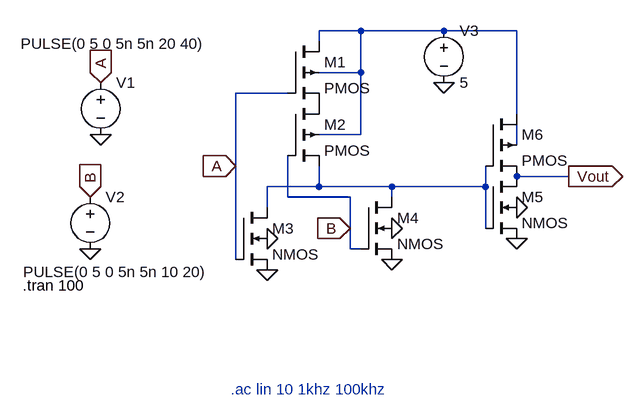
[diagram p0: schematic OR gate.asc]
OR gate.asc, the LTspice schematic file:
Version 4.1
SHEET 1 880 752
WIRE 288 48 224 48
WIRE 416 48 288 48
WIRE 528 48 416 48
WIRE 224 64 224 48
WIRE 288 112 288 48
WIRE 288 112 224 112
WIRE 176 144 96 144
WIRE 528 176 528 48
WIRE 288 208 288 112
WIRE 288 208 224 208
WIRE 528 224 528 192
WIRE 96 256 96 144
WIRE 608 272 528 272
WIRE 224 288 224 256
WIRE 224 288 144 288
WIRE 336 288 224 288
WIRE 480 288 480 256
WIRE 480 288 336 288
WIRE 176 304 176 240
WIRE 272 304 176 304
WIRE 336 304 336 288
WIRE 144 320 144 288
WIRE 272 352 272 304
WIRE 480 352 480 288
WIRE 272 384 272 352
WIRE 288 384 272 384
WIRE 96 400 96 256
FLAG -128 384 0
FLAG -112 208 0
FLAG 144 416 0
FLAG 336 400 0
FLAG 336 352 0
FLAG 144 368 0
FLAG 416 128 0
FLAG -112 128 A
IOPIN -112 128 In
FLAG 96 256 A
IOPIN 96 256 In
FLAG -128 304 B
IOPIN -128 304 In
FLAG 272 352 B
IOPIN 272 352 In
FLAG 528 368 0
FLAG 528 320 0
FLAG 608 272 Vout
IOPIN 608 272 Out
DATAFLAG -128 304 ""
SYMBOL pmos4 176 64 R0
SYMATTR InstName M1
SYMBOL pmos4 176 160 R0
SYMATTR InstName M2
SYMBOL nmos4 96 320 R0
SYMATTR InstName M3
SYMBOL nmos4 288 304 R0
SYMATTR InstName M4
SYMBOL voltage -112 112 R0
WINDOW 3 -123 -44 Left 2
WINDOW 123 0 0 Left 0
WINDOW 39 0 0 Left 0
SYMATTR Value PULSE(0 5 0 5n 5n 20 40)
SYMATTR InstName V1
SYMBOL voltage -128 288 R0
WINDOW 3 -103 131 Left 2
WINDOW 123 0 0 Left 0
WINDOW 39 0 0 Left 0
SYMATTR Value PULSE(0 5 0 5n 5n 10 20)
SYMATTR InstName V2
SYMBOL voltage 416 32 R0
WINDOW 123 0 0 Left 0
WINDOW 39 0 0 Left 0
SYMATTR InstName V3
SYMATTR Value 5
SYMBOL nmos4 480 272 R0
SYMATTR InstName M5
SYMBOL pmos4 480 176 R0
SYMATTR InstName M6
TEXT -232 440 Left 2 !.tran 100
TEXT 88 600 Left 2 ;.ac lin 10 1khz 100khz

The netlist it stands for:
* OR gate.asc
M1 N001 A P001 N001 PMOS
M2 P001 B N003 N001 PMOS
M3 N003 A 0 0 NMOS
M4 N003 B 0 0 NMOS
V1 A 0 PULSE(0 5 0 5n 5n 20 40)
V2 B 0 PULSE(0 5 0 5n 5n 10 20)
V3 N001 0 5
M5 Vout N003 0 0 NMOS
M6 N001 N003 Vout N002 PMOS
.model NMOS NMOS
.model PMOS PMOS
.lib standard.mos
.tran 100
* .ac lin 10 1khz 100khz
.backanno
.end